# Altium project ESP32_Remote_Control.PrjPcb
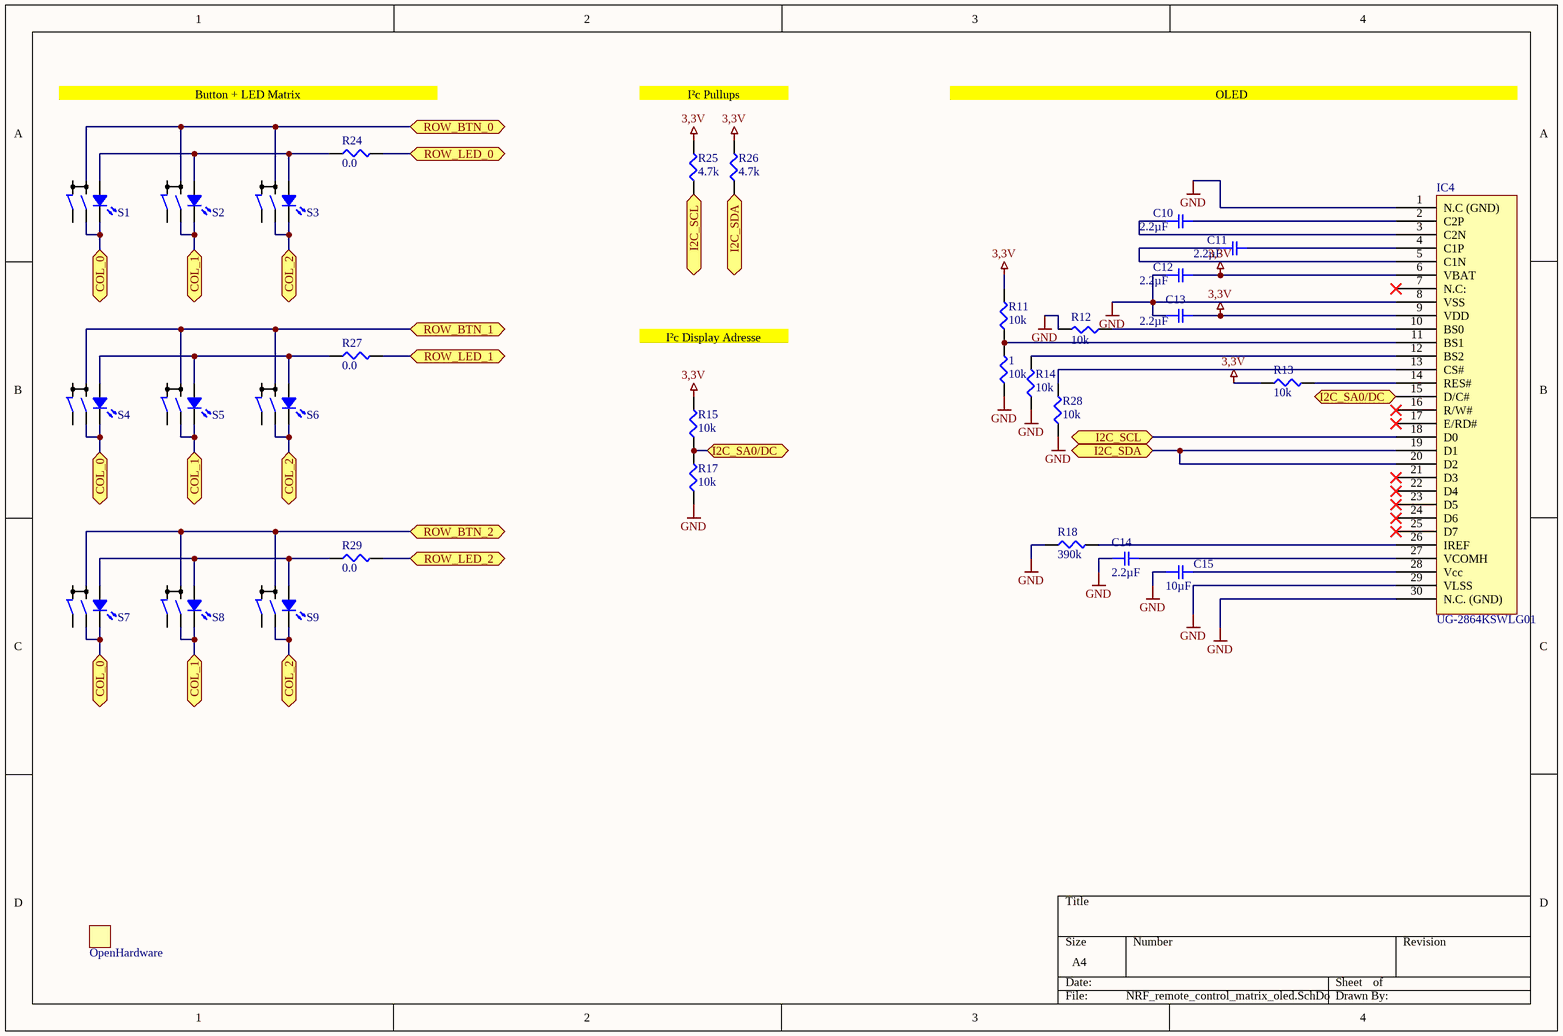
[diagram p0: NRF_remote_control_matrix_oled.SchDoc]
2 sheets, 69 parts. Net scope: flat (ports and power ports of the same name join across sheets).
Board file: NRF_remote_control.PcbDoc
Sheets:
  NRF_remote_control_matrix_oled.SchDoc
  NRF_remote_control_main.SchDoc

## Sheet NRF_remote_control_matrix_oled.SchDoc
size A4

### Parts
1  10k  [SMD-0603-RES]
C10  2.2µF  [SMD-0603C]
C11  2.2µF  [SMD-0603C]
C12  2.2µF  [SMD-0603C]
C13  2.2µF  [SMD-0603C]
C14  2.2µF  [SMD-0603C]
C15  10µF  [SMD-0603C]
IC4  UG-2864KSWLG01  [UG-2864KSWLG01]
R11  10k  [SMD-0603-RES]
R12  10k  [SMD-0603-RES]
R13  10k  [SMD-0603-RES]
R14  10k  [SMD-0603-RES]
R15  10k  [SMD-0603-RES]
R17  10k  [SMD-0603-RES]
R18  390k  [SMD-0603-RES]
R24  0.0  [SMD-0603-RES]
R25  4.7k  [SMD-0603-RES]
R26  4.7k  [SMD-0603-RES]
R27  0.0  [SMD-0603-RES]
R28  10k  [SMD-0603-RES]
R29  0.0  [SMD-0603-RES]
S1  MP86A0BUH-G  [MP86A0BUH-G]  (value not drawn)
S2  MP86A0BUH-G  [MP86A0BUH-G]  (value not drawn)
S3  MP86A0BUH-G  [MP86A0BUH-G]  (value not drawn)
S4  MP86A0BUH-G  [MP86A0BUH-G]  (value not drawn)
S5  MP86A0BUH-G  [MP86A0BUH-G]  (value not drawn)
S6  MP86A0BUH-G  [MP86A0BUH-G]  (value not drawn)
S7  MP86A0BUH-G  [MP86A0BUH-G]  (value not drawn)
S8  MP86A0BUH-G  [MP86A0BUH-G]  (value not drawn)
S9  MP86A0BUH-G  [MP86A0BUH-G]  (value not drawn)
  OpenHardware  [OpenHardware]

### Ports
COL_0 (bidir), COL_1 (bidir), COL_2 (bidir), I2C_SA0/DC (bidir), I2C_SCL (bidir), I2C_SDA (bidir), ROW_BTN_0 (bidir), ROW_BTN_1 (bidir), ROW_BTN_2 (bidir), ROW_LED_0 (bidir), ROW_LED_1 (bidir), ROW_LED_2 (bidir)

### Nets
3,3V: C12.2 C13.2 IC4.6(VBAT) IC4.9(VDD) R11.2 R13.1 R15.2 R25.2 R26.2
GND: 1.1 C12.1 C13.1 C14.1 C15.1 IC4.1(N.C_(GND)) IC4.8(VSS) IC4.29(VLSS) IC4.30(N.C._(GND)) R12.2 R14.1 R17.1 R18.1 R28.1
Net1_2: 1.2 IC4.11(BS1) R11.1
NetC10_1: C10.1 IC4.3(C2N)
NetC10_2: C10.2 IC4.2(C2P)
NetC11_1: C11.1 IC4.5(C1N)
NetC11_2: C11.2 IC4.4(C1P)
NetC14_2: C14.2 IC4.27(VCOMH)
NetC15_2: C15.2 IC4.28(Vcc)
NetIC2_11: S3.2 S3.C(K) S6.2 S6.C(K) S9.2 S9.C(K) ; port COL_2
NetIC2_12: S2.2 S2.C(K) S5.2 S5.C(K) S8.2 S8.C(K) ; port COL_1
NetIC2_22: IC4.15(D/C#) R15.1 R17.2 ; port I2C_SA0/DC
NetIC2_31: S1.2 S1.C(K) S4.2 S4.C(K) S7.2 S7.C(K) ; port COL_0
NetIC2_38: R24.2 ; port ROW_LED_0
NetIC2_39: S1.1 S2.1 S3.1 ; port ROW_BTN_0
NetIC2_40: R27.2 ; port ROW_LED_1
NetIC2_41: S4.1 S5.1 S6.1 ; port ROW_BTN_1
NetIC2_42: IC4.18(D0) R25.1 ; port I2C_SCL
NetIC2_43: IC4.19(D1) IC4.20(D2) R26.1 ; port I2C_SDA
NetIC2_45: R29.2 ; port ROW_LED_2
NetIC2_46: S7.1 S8.1 S9.1 ; port ROW_BTN_2
NetIC4_10: IC4.10(BS0) R12.1
NetIC4_12: IC4.12(BS2) R14.2
NetIC4_13: IC4.13(CS#) R28.2
NetIC4_14: IC4.14(RES#) R13.2
NetIC4_26: IC4.26(IREF) R18.2
NetR24_1: R24.1 S1.B(A) S2.B(A) S3.B(A)
NetR27_1: R27.1 S4.B(A) S5.B(A) S6.B(A)
NetR29_1: R29.1 S7.B(A) S8.B(A) S9.B(A)

Not connected (* = marked no-connect by the designer): IC4 7(N.C:)* 16(R/W#)* 17(E/RD#)* 21(D3)* 22(D4)* 23(D5)* 24(D6)* 25(D7)*; S1 3; S2 3; S3 3; S4 3; S5 3; S6 3; S7 3; S8 3; S9 3

### Notes on the sheet
- Button + LED Matrix
- I²c Pullups
- OLED
- I²c Display Adresse

### Library data of the parts
1 R11-R15 R17 R28 = ERJ-3EKF1002V: RES SMD 10K OHM 1% 1/10W 0603; Manufacturer: Panasonic Electronic Components; Factory Stock: 0; Unit Price (USD): 0.00379; @ qty: 1500; Minimum Quantity: 1; Power (Watts): 0.1W, 1/10W; Temperature Coefficient: ±100ppm/°C; Part Number: ERJ-3EKF1002V; Datasheets: http://industrial.panasonic.com/www-cgi/jvcr13pz.cgi?E+PZ+3+AOA0002+ERJ3EKF1002V+7+WW; Image: //media.digikey.com/Photos/Panasonic%20Photos/MFG_ERJ-P6W%20Series.jpg; Digi-Key Part Number: P10.0KHCT-ND; Quantity Available: 6703141; Packaging: Cut Tape (CT); Series: ERJ; Part Status: Active; Value: 10k; Tolerance: ±1%; Composition: Thick Film; Features: Automotive AEC-Q200; Operating Temperature: -55°C ~ 155°C; Package / Case: 0603 (1608 Metric); Supplier Device Package: 0603; Size / Dimension: 0.063" L x 0.031" W (1.60mm x 0.80mm); Height - Seated (Max): 0.022" (0.55mm); Number of Terminations: 2; Failure Rate: -
C10-C14 = GRM188C81C225KA12D: CAP CER 2.2UF 16V X6S 0603; Manufacturer: Murata Electronics North America; Factory Stock: 0; Unit Price (USD): 0.2; Minimum Quantity: 1; Tolerance: ±10%; Datasheets: http://www.murata.com/~/media/webrenewal/support/library/catalog/products/capacitor/mlcc/c02e.pdf; Image: //media.digikey.com/Renders/Murata%20Renders/ZRB-SERIES-0402.jpg; Digi-Key Part Number: 490-11993-1-ND; Part Number: GRM188C81C225KA12D; Quantity Available: 1215; @ qty: 0; Packaging: Cut Tape (CT); Series: GRM; Part Status: Active; Value: 2.2µF; Voltage: 16V; Temperature Coefficient: X6S; Operating Temperature: -55°C ~ 105°C; Features: -; Ratings: -; Applications: General Purpose; Mounting Type: Surface Mount, MLCC; Package / Case: 0603 (1608 Metric); Size / Dimension: 0.063" L x 0.031" W (1.60mm x 0.80mm); Height - Seated (Max): -; Thickness (Max): 0.035" (0.90mm); Lead Spacing: -; Lead Style: -
C15 = GRM185R60J106ME15D: CAP CER 10UF 6.3V X5R 0603; Manufacturer: Murata Electronics North America; Factory Stock: 0; Unit Price (USD): 0.36; Minimum Quantity: 1; Tolerance: ±20%; Datasheets: http://www.murata.com/~/media/webrenewal/support/library/catalog/products/capacitor/mlcc/c02e.pdf; Image: //media.digikey.com/Renders/Murata%20Renders/ZRB-SERIES-0402.jpg; Digi-Key Part Number: 490-10467-1-ND; Part Number: GRM185R60J106ME15D; Quantity Available: 25068; @ qty: 0; Packaging: Cut Tape (CT); Series: GRM; Part Status: Active; Value: 10µF; Voltage: 6.3V; Temperature Coefficient: X5R; Operating Temperature: -55°C ~ 85°C; Features: Derating Recommended; Ratings: -; Applications: General Purpose; Mounting Type: Surface Mount, MLCC; Package / Case: 0603 (1608 Metric); Size / Dimension: 0.063" L x 0.031" W (1.60mm x 0.80mm); Height - Seated (Max): -; Thickness (Max): 0.022" (0.55mm); Lead Spacing: -; Lead Style: -
IC4 = UG-2864KSWLG01: OLED 1,3" 128x64
R18 = ERJ-3EKF3903V: RES SMD 390K OHM 1% 1/10W 0603; Manufacturer: Panasonic Electronic Components; Factory Stock: 0; Unit Price (USD): 0.00379; @ qty: 1500; Minimum Quantity: 1; Power (Watts): 0.1W, 1/10W; Temperature Coefficient: ±100ppm/°C; Part Number: ERJ-3EKF3903V; Datasheets: http://industrial.panasonic.com/www-cgi/jvcr13pz.cgi?E+PZ+3+AOA0002+ERJ3EKF3903V+7+WW; Image: //media.digikey.com/Photos/Panasonic%20Photos/MFG_ERJ-P6W%20Series.jpg; Digi-Key Part Number: P390KHCT-ND; Quantity Available: 25618; Packaging: Cut Tape (CT); Series: ERJ; Part Status: Active; Value: 390k; Tolerance: ±1%; Composition: Thick Film; Features: Automotive AEC-Q200; Operating Temperature: -55°C ~ 155°C; Package / Case: 0603 (1608 Metric); Supplier Device Package: 0603; Size / Dimension: 0.063" L x 0.031" W (1.60mm x 0.80mm); Height - Seated (Max): 0.022" (0.55mm); Number of Terminations: 2; Failure Rate: -
R24 R27 R29 = ERJ-3GEY0R00V: RES SMD 0.0OHM JUMPER 1/10W 0603; Manufacturer: Panasonic Electronic Components; Factory Stock: 0; Unit Price (USD): 0.00352; @ qty: 1500; Minimum Quantity: 1; Power (Watts): 0.1W, 1/10W; Part Number: ERJ-3GEY0R00V; Datasheets: http://industrial.panasonic.com/www-cgi/jvcr13pz.cgi?E+PZ+3+AOA0001+ERJ3GEY0R00V+7+WW; Image: //media.digikey.com/Photos/Panasonic%20Photos/MFG_ERJ-P6W%20Series.jpg; Digi-Key Part Number: P0.0GCT-ND; Quantity Available: 4813372; Packaging: Cut Tape (CT); Series: ERJ; Part Status: Active; Value: 0.0; Tolerance: Jumper; Composition: Thick Film; Features: Automotive AEC-Q200; Temperature Coefficient: -; Operating Temperature: -55°C ~ 155°C; Package / Case: 0603 (1608 Metric); Supplier Device Package: 0603; Size / Dimension: 0.063" L x 0.031" W (1.60mm x 0.80mm); Height - Seated (Max): 0.022" (0.55mm); Number of Terminations: 2; Failure Rate: -
R25 R26 = ERJ-PA3F4701V: RES SMD 4.7K OHM 1% 1/4W 0603; Manufacturer: Panasonic Electronic Components; Factory Stock: 0; Unit Price (USD): 0.02372; @ qty: 1500; Minimum Quantity: 1; Power (Watts): 0.25W, 1/4W; Temperature Coefficient: ±100ppm/°C; Part Number: ERJ-PA3F4701V; Datasheets: https://industrial.panasonic.com/cdbs/www-data/pdf/RDA0000/AOA0000C243.pdf; Image: //media.digikey.com/Photos/Panasonic%20Photos/MFG_ERJ-P6W%20Series.jpg; Digi-Key Part Number: P4.7KBYCT-ND; Quantity Available: 14801; Packaging: Cut Tape (CT); Series: ERJ; Part Status: Active; Value: 4.7k; Tolerance: ±1%; Composition: Thick Film; Features: Automotive AEC-Q200, Pulse Withstanding; Operating Temperature: -55°C ~ 155°C; Package / Case: 0603 (1608 Metric); Supplier Device Package: 0603; Size / Dimension: 0.063" L x 0.031" W (1.60mm x 0.80mm); Height - Seated (Max): 0.022" (0.55mm); Number of Terminations: 2; Failure Rate: -
S1-S9 = MP86A0BUH-G: Button mit LED
 = OpenHardware: OpenHardware Logo

## Sheet NRF_remote_control_main.SchDoc
size A4
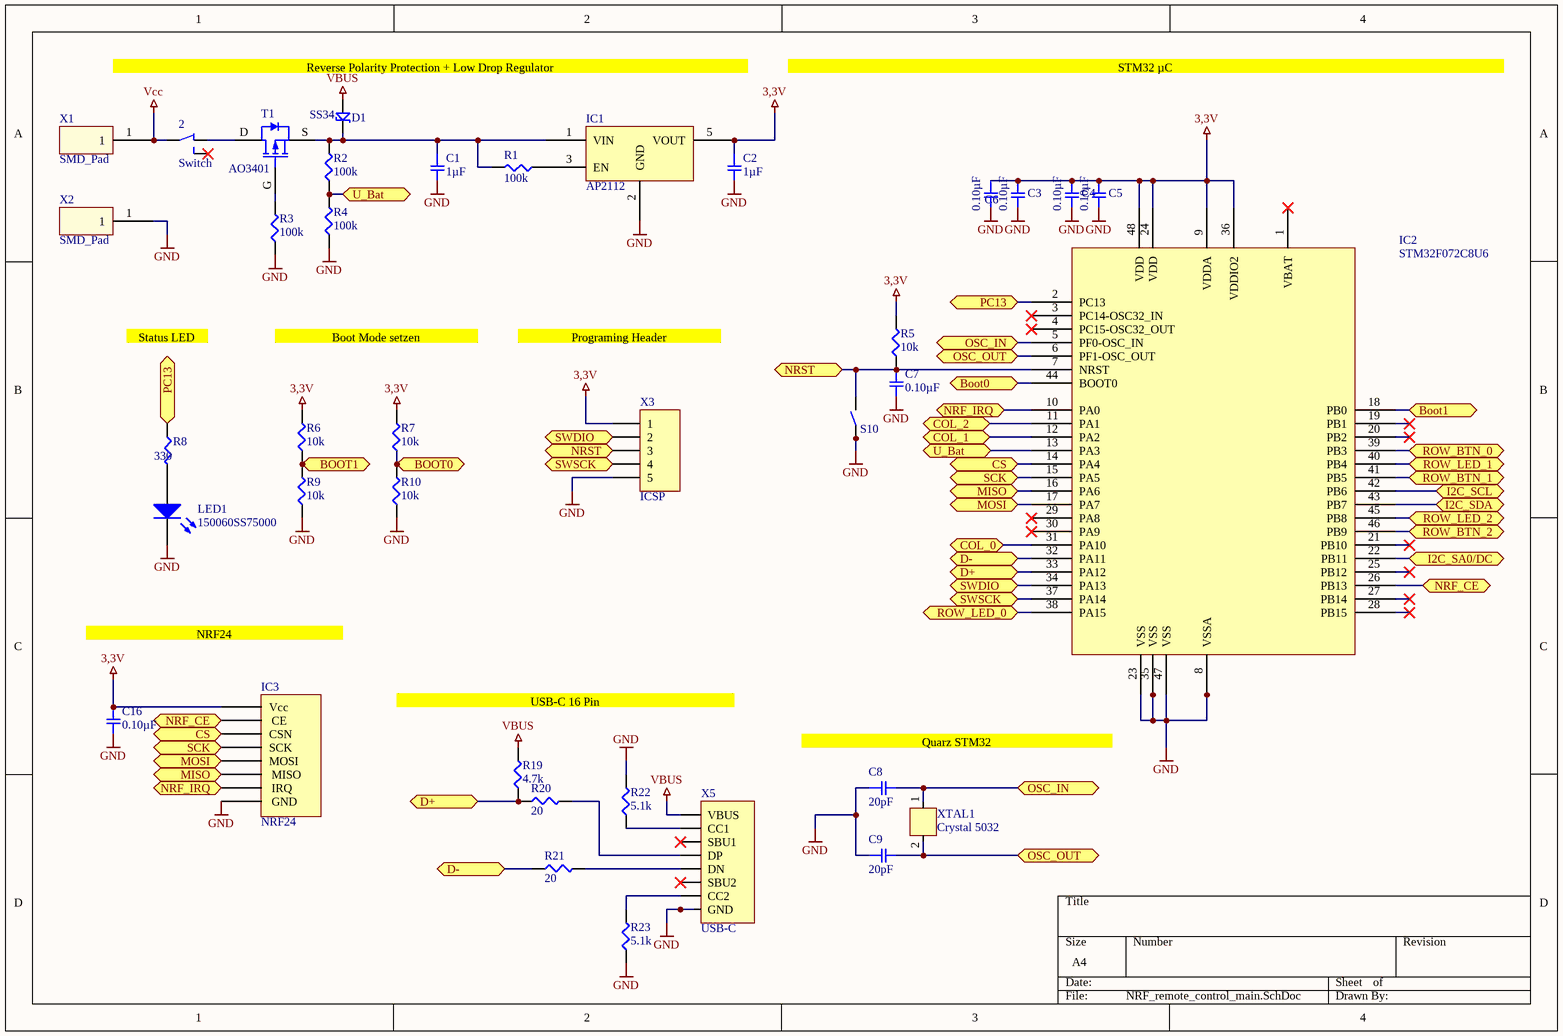
[diagram p1: NRF_remote_control_main.SchDoc]

### Parts
2  Switch  [K3-1296S-J1]
C1  1µF  [SMD-0603C]
C2  1µF  [SMD-0603C]
C3  0.10µF  [SMD-0603C]
C4  0.10µF  [SMD-0603C]
C5  0.10µF  [SMD-0603C]
C6  0.10µF  [SMD-0603C]
C7  0.10µF  [SMD-0603C]
C8  20pF  [SMD-0603C]
C9  20pF  [SMD-0603C]
C16  0.10µF  [SMD-0603C]
D1  SS34  [B240A]
IC1  AP2112  [SOT23-5]
IC2  STM32F072C8U6  [LQFP-48]
IC3  NRF24  [ML01SP4]
LED1  150060SS75000  [0603_A]
R1  100k  [SMD-0603-RES]
R2  100k  [SMD-0603-RES]
R3  100k  [SMD-0603-RES]
R4  100k  [SMD-0603-RES]
R5  10k  [SMD-0603-RES]
R6  10k  [SMD-0603-RES]
R7  10k  [SMD-0603-RES]
R8  330  [SMD-0603-RES]
R9  10k  [SMD-0603-RES]
R10  10k  [SMD-0603-RES]
R19  4.7k  [SMD-0603-RES]
R20  20  [SMD-0603-RES]
R21  20  [SMD-0603-RES]
R22  5.1k  [SMD-0603-RES]
R23  5.1k  [SMD-0603-RES]
S10  Button  [Button5050]  (value not drawn)
T1  AO3401  [SOT23]
X1  SMD_Pad  [SMD_Pad]
X2  SMD_Pad  [SMD_Pad]
X3  ICSP  [TC2030-MCP-NL]
X5  USB-C  [USB-C]
XTAL1  Crystal 5032  [5032]

### Ports
Boot0 (bidir), BOOT0 (bidir), Boot1 (bidir), BOOT1 (bidir), COL_0 (bidir), COL_1 (bidir), COL_2 (bidir), CS (bidir), D+ (bidir), D- (bidir), I2C_SA0/DC (bidir), I2C_SCL (bidir), I2C_SDA (bidir), MISO (bidir), MOSI (bidir), NRF_CE (bidir), NRF_IRQ (bidir), NRST (bidir), OSC_IN (bidir), OSC_OUT (bidir), PC13 (bidir), ROW_BTN_0 (bidir), ROW_BTN_1 (bidir), ROW_BTN_2 (bidir), ROW_LED_0 (bidir), ROW_LED_1 (bidir), ROW_LED_2 (bidir), SCK (bidir), SWDIO (bidir), SWSCK (bidir), U_Bat (bidir)

### Nets
3,3V: C2.1 C3.1 C4.1 C5.1 C6.1 C16.1 IC1.5(VOUT) IC2.9(VDDA) IC2.24(VDD) IC2.36(VDDIO2) IC2.48(VDD) IC3.Vcc R5.2 R6.2 R7.2 X3.1
GND: C1.2 C2.2 C3.2 C4.2 C5.2 C6.2 C7.2 C8.1 C9.1 C16.2 IC1.2(GND) IC2.8(VSSA) IC2.23(VSS) IC2.35(VSS) IC2.47(VSS) IC3.Gnd(GND) LED1.1(K) R3.1 R4.1 R9.1 R10.1 R22.2 R23.1 S10.1 X2.1 X3.5 X5.GND
VBUS: D1.A R19.2 X5.VBUS
Vcc: 2.3 X1.1
Net2_1: 2.1 T1.D
NetC1_1: C1.1 D1.K IC1.1(VIN) R1.2 R2.2 T1.S
NetC7_1: C7.1 IC2.7(NRST) R5.1 S10.2 X3.3 ; port NRST
NetC8_2: C8.2 IC2.5(PF0-OSC_IN) XTAL1.1 ; port OSC_IN
NetC9_2: C9.2 IC2.6(PF1-OSC_OUT) XTAL1.2 ; port OSC_OUT
NetIC1_3: IC1.3(EN) R1.1
NetIC2_2: IC2.2(PC13) R8.1 ; port PC13
NetIC2_10: IC2.10(PA0) IC3.IRQ ; port NRF_IRQ
NetIC2_11: IC2.11(PA1) ; port COL_2
NetIC2_12: IC2.12(PA2) ; port COL_1
NetIC2_13: IC2.13(PA3) R2.1 R4.2 ; port U_Bat
NetIC2_14: IC2.14(PA4) IC3.CSN ; port CS
NetIC2_15: IC2.15(PA5) IC3.SCK ; port SCK
NetIC2_16: IC2.16(PA6) IC3.MISO ; port MISO
NetIC2_17: IC2.17(PA7) IC3.MOSI ; port MOSI
NetIC2_18: IC2.18(PB0) R6.1 R9.2 ; port Boot1, port BOOT1
NetIC2_22: IC2.22(PB11) ; port I2C_SA0/DC
NetIC2_26: IC2.26(PB13) IC3.CE ; port NRF_CE
NetIC2_31: IC2.31(PA10) ; port COL_0
NetIC2_32: IC2.32(PA11) R21.1 ; port D-
NetIC2_33: IC2.33(PA12) R19.1 R20.1 ; port D+
NetIC2_34: IC2.34(PA13) X3.2 ; port SWDIO
NetIC2_37: IC2.37(PA14) X3.4 ; port SWSCK
NetIC2_38: IC2.38(PA15) ; port ROW_LED_0
NetIC2_39: IC2.39(PB3) ; port ROW_BTN_0
NetIC2_40: IC2.40(PB4) ; port ROW_LED_1
NetIC2_41: IC2.41(PB5) ; port ROW_BTN_1
NetIC2_42: IC2.42(PB6) ; port I2C_SCL
NetIC2_43: IC2.43(PB7) ; port I2C_SDA
NetIC2_44: IC2.44(BOOT0) R7.1 R10.2 ; port Boot0, port BOOT0
NetIC2_45: IC2.45(PB8) ; port ROW_LED_2
NetIC2_46: IC2.46(PB9) ; port ROW_BTN_2
NetLED1_2: LED1.2(A) R8.2
NetR3_2: R3.2 T1.G
NetR20_2: R20.2 X5.DP
NetR21_2: R21.2 X5.DN
NetR22_1: R22.1 X5.CC1
NetR23_2: R23.2 X5.CC2

Not connected (* = marked no-connect by the designer): 2 2*; IC2 1(VBAT)* 3(PC14-OSC32_IN)* 4(PC15-OSC32_OUT)* 19(PB1)* 20(PB2)* 21(PB10)* 25(PB12)* 27(PB14)* 28(PB15)* 29(PA8)* 30(PA9)*; X5 SBU1*

### Notes on the sheet
- (near D1) Reverse Polarity Protection + Low Drop Regulator
- STM32 µC
  STM32 µC
- Status LED
- Boot Mode setzen
- Programing Header
- NRF24
- USB-C 16 Pin
- Quarz STM32

### Library data of the parts
C1 C2 = GCM188R71C105KA64D: CAP CER 1UF 16V X7R 0603; Manufacturer: Murata Electronics North America; Factory Stock: 0; Unit Price (USD): 0.24; Minimum Quantity: 1; Tolerance: ±10%; Datasheets: http://www.murata.com/~/media/webrenewal/support/library/catalog/products/capacitor/mlcc/c03e.ashx; Image: //media.digikey.com/Renders/Murata%20Renders/0603%28GCM188%29.jpg; Digi-Key Part Number: 490-5241-1-ND; Part Number: GCM188R71C105KA64D; Quantity Available: 9243; @ qty: 0; Packaging: Cut Tape (CT); Series: GCM; Part Status: Active; Value: 1µF; Voltage: 16V; Temperature Coefficient: X7R; Operating Temperature: -55°C ~ 125°C; Features: -; Ratings: AEC-Q200; Applications: Automotive; Mounting Type: Surface Mount, MLCC; Package / Case: 0603 (1608 Metric); Size / Dimension: 0.063" L x 0.031" W (1.60mm x 0.80mm); Height - Seated (Max): -; Thickness (Max): 0.035" (0.90mm); Lead Spacing: -; Lead Style: -
C3-C9 C16 = GCM188R71C104KA37J: CAP CER 0.1UF 16V X7R 0603; Manufacturer: Murata Electronics North America; Factory Stock: 0; Unit Price (USD): 0.18; Minimum Quantity: 1; Tolerance: ±10%; Datasheets: http://www.murata.com/~/media/webrenewal/support/library/catalog/products/capacitor/mlcc/c03e.ashx; Image: //media.digikey.com/Renders/Murata%20Renders/0603%28GCM188%29.jpg; Digi-Key Part Number: 490-8015-1-ND; Part Number: GCM188R71C104KA37J; Quantity Available: 17844; @ qty: 0; Packaging: Cut Tape (CT); Series: GCM; Part Status: Active; Voltage: 16V; Temperature Coefficient: X7R; Operating Temperature: -55°C ~ 125°C; Features: -; Ratings: AEC-Q200; Applications: Automotive; Mounting Type: Surface Mount, MLCC; Package / Case: 0603 (1608 Metric); Size / Dimension: 0.063" L x 0.031" W (1.60mm x 0.80mm); Height - Seated (Max): -; Thickness (Max): 0.035" (0.90mm); Lead Spacing: -; Lead Style: -
  C3-C7 C16: Value: 0.10µF
  C8 C9: Value: 20pF
D1 = B240A: Shottkydiode
LED1 = 150060SS75000: SMD mono-color Chip LED, WL-SMCW, Super Red; PackageReference: 0603_A; Color: Super Red; PartNumber: 150060SS75000; ComponentLink1Description: Manufacturer URL; ComponentLink1URL: http://www.we-online.com; ComponentLink2Description: Datasheet; ComponentLink2URL: http://katalog.we-online.com/led/datasheet/150060SS75000.pdf
R1-R4 R19 = ERJ-3EKF4701V: RES SMD 4.7K OHM 1% 1/10W 0603; Manufacturer: Panasonic Electronic Components; Factory Stock: 0; Unit Price (USD): 0.00379; @ qty: 1500; Minimum Quantity: 1; Power (Watts): 0.1W, 1/10W; Temperature Coefficient: ±100ppm/°C; Part Number: ERJ-3EKF4701V; Datasheets: http://industrial.panasonic.com/www-cgi/jvcr13pz.cgi?E+PZ+3+AOA0002+ERJ3EKF4701V+7+WW; Image: //media.digikey.com/Photos/Panasonic%20Photos/MFG_ERJ-P6W%20Series.jpg; Digi-Key Part Number: P4.70KHCT-ND; Quantity Available: 999380; Packaging: Cut Tape (CT); Series: ERJ; Part Status: Active; Tolerance: ±1%; Composition: Thick Film; Features: Automotive AEC-Q200; Operating Temperature: -55°C ~ 155°C; Package / Case: 0603 (1608 Metric); Supplier Device Package: 0603; Size / Dimension: 0.063" L x 0.031" W (1.60mm x 0.80mm); Height - Seated (Max): 0.022" (0.55mm); Number of Terminations: 2; Failure Rate: -
  R1-R4: Value: 100k
  R19: Value: 4.7k
R5-R7 R9 R10 = ERJ-3EKF1002V: as 1 on sheet NRF_remote_control_matrix_oled; Part Number: ERJ-3EKF1002V; Datasheets: http://industrial.panasonic.com/www-cgi/jvcr13pz.cgi?E+PZ+3+AOA0002+ERJ3EKF1002V+7+WW; Image: //media.digikey.com/Photos/Panasonic%20Photos/MFG_ERJ-P6W%20Series.jpg; Digi-Key Part Number: P10.0KHCT-ND; Quantity Available: 6703141; Packaging: Cut Tape (CT); Series: ERJ; Part Status: Active; Value: 10k; Tolerance: ±1%; Composition: Thick Film; Features: Automotive AEC-Q200; Operating Temperature: -55°C ~ 155°C; Package / Case: 0603 (1608 Metric); Supplier Device Package: 0603; Size / Dimension: 0.063" L x 0.031" W (1.60mm x 0.80mm); Height - Seated (Max): 0.022" (0.55mm); Number of Terminations: 2; Failure Rate: -
R8 = ERJ-3EKF3300V: RES SMD 330 OHM 1% 1/10W 0603; Manufacturer: Panasonic Electronic Components; Factory Stock: 0; Unit Price (USD): 0.00379; @ qty: 1500; Minimum Quantity: 1; Power (Watts): 0.1W, 1/10W; Temperature Coefficient: ±100ppm/°C; Part Number: ERJ-3EKF3300V; Datasheets: http://industrial.panasonic.com/www-cgi/jvcr13pz.cgi?E+PZ+3+AOA0002+ERJ3EKF3300V+7+WW; Image: //media.digikey.com/Photos/Panasonic%20Photos/MFG_ERJ-P6W%20Series.jpg; Digi-Key Part Number: P330HCT-ND; Quantity Available: 670984; Packaging: Cut Tape (CT); Series: ERJ; Part Status: Active; Value: 330; Tolerance: ±1%; Composition: Thick Film; Features: Automotive AEC-Q200; Operating Temperature: -55°C ~ 155°C; Package / Case: 0603 (1608 Metric); Supplier Device Package: 0603; Size / Dimension: 0.063" L x 0.031" W (1.60mm x 0.80mm); Height - Seated (Max): 0.022" (0.55mm); Number of Terminations: 2; Failure Rate: -
R20 R21 = ERJ-3EKF20R0V: RES SMD 20 OHM 1% 1/10W 0603; Manufacturer: Panasonic Electronic Components; Factory Stock: 0; Unit Price (USD): 0.00379; @ qty: 1500; Minimum Quantity: 1; Power (Watts): 0.1W, 1/10W; Temperature Coefficient: ±100ppm/°C; Part Number: ERJ-3EKF20R0V; Datasheets: http://industrial.panasonic.com/www-cgi/jvcr13pz.cgi?E+PZ+3+AOA0002+ERJ3EKF20R0V+7+WW; Image: //media.digikey.com/Photos/Panasonic%20Photos/MFG_ERJ-P6W%20Series.jpg; Digi-Key Part Number: P20.0HCT-ND; Quantity Available: 92419; Packaging: Cut Tape (CT); Series: ERJ; Part Status: Active; Value: 20; Tolerance: ±1%; Composition: Thick Film; Features: Automotive AEC-Q200; Operating Temperature: -55°C ~ 155°C; Package / Case: 0603 (1608 Metric); Supplier Device Package: 0603; Size / Dimension: 0.063" L x 0.031" W (1.60mm x 0.80mm); Height - Seated (Max): 0.022" (0.55mm); Number of Terminations: 2; Failure Rate: -
R22 R23 = ERJ-3GEYJ512V: RES SMD 5.1K OHM 5% 1/10W 0603; Manufacturer: Panasonic Electronic Components; Factory Stock: 0; Unit Price (USD): 0.00321; @ qty: 1500; Minimum Quantity: 1; Power (Watts): 0.1W, 1/10W; Temperature Coefficient: ±200ppm/°C; Part Number: ERJ-3GEYJ512V; Datasheets: http://industrial.panasonic.com/www-cgi/jvcr13pz.cgi?E+PZ+3+AOA0001+ERJ3GEYJ512V+7+WW; Image: //media.digikey.com/Photos/Panasonic%20Photos/MFG_ERJ-P6W%20Series.jpg; Digi-Key Part Number: P5.1KGCT-ND; Quantity Available: 285626; Packaging: Cut Tape (CT); Series: ERJ; Part Status: Active; Value: 5.1k; Tolerance: ±5%; Composition: Thick Film; Features: Automotive AEC-Q200; Operating Temperature: -55°C ~ 155°C; Package / Case: 0603 (1608 Metric); Supplier Device Package: 0603; Size / Dimension: 0.063" L x 0.031" W (1.60mm x 0.80mm); Height - Seated (Max): 0.022" (0.55mm); Number of Terminations: 2; Failure Rate: -
S10 = Button: 6.1x3.7x2.5mm
T1 = AO3401: AO3401 MOSFET 30V
X5 = USB-C 16P
XTAL1 = 5032

## Nets that join several sheets
3,3V: NRF_remote_control_matrix_oled (9 pins), NRF_remote_control_main (16 pins)
GND: NRF_remote_control_matrix_oled (14 pins), NRF_remote_control_main (27 pins)
NetIC2_11: NRF_remote_control_matrix_oled (6 pins), NRF_remote_control_main (IC2.11)
NetIC2_12: NRF_remote_control_matrix_oled (6 pins), NRF_remote_control_main (IC2.12)
NetIC2_22: NRF_remote_control_matrix_oled (IC4.15 R15.1 R17.2), NRF_remote_control_main (IC2.22)
NetIC2_31: NRF_remote_control_matrix_oled (6 pins), NRF_remote_control_main (IC2.31)
NetIC2_38: NRF_remote_control_matrix_oled (R24.2), NRF_remote_control_main (IC2.38)
NetIC2_39: NRF_remote_control_matrix_oled (S1.1 S2.1 S3.1), NRF_remote_control_main (IC2.39)
NetIC2_40: NRF_remote_control_matrix_oled (R27.2), NRF_remote_control_main (IC2.40)
NetIC2_41: NRF_remote_control_matrix_oled (S4.1 S5.1 S6.1), NRF_remote_control_main (IC2.41)
NetIC2_42: NRF_remote_control_matrix_oled (IC4.18 R25.1), NRF_remote_control_main (IC2.42)
NetIC2_43: NRF_remote_control_matrix_oled (IC4.19 IC4.20 R26.1), NRF_remote_control_main (IC2.43)
NetIC2_45: NRF_remote_control_matrix_oled (R29.2), NRF_remote_control_main (IC2.45)
NetIC2_46: NRF_remote_control_matrix_oled (S7.1 S8.1 S9.1), NRF_remote_control_main (IC2.46)